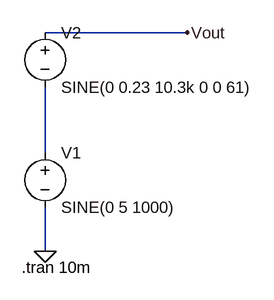
[diagram p0: schematic Task1.asc]
Task1.asc, the LTspice schematic file:
Version 4
SHEET 1 900 680
WIRE 272 -112 64 -112
WIRE 64 64 64 -32
WIRE 64 208 64 144
FLAG 64 208 0
FLAG 272 -112 Vout
SYMBOL voltage 64 48 R0
WINDOW 123 0 0 Left 0
WINDOW 39 0 0 Left 0
SYMATTR InstName V1
SYMATTR Value SINE(0 5 1000)
SYMBOL voltage 64 -128 R0
WINDOW 123 0 0 Left 0
WINDOW 39 0 0 Left 0
SYMATTR InstName V2
SYMATTR Value SINE(0 0.23 10.3k 0 0 61)
TEXT 30 232 Left 2 !.tran 10m

The netlist it stands for:
* Task1.asc
V1 N001 0 SINE(0 5 1000)
V2 Vout N001 SINE(0 0.23 10.3k 0 0 61)
.tran 10m
.backanno
.end